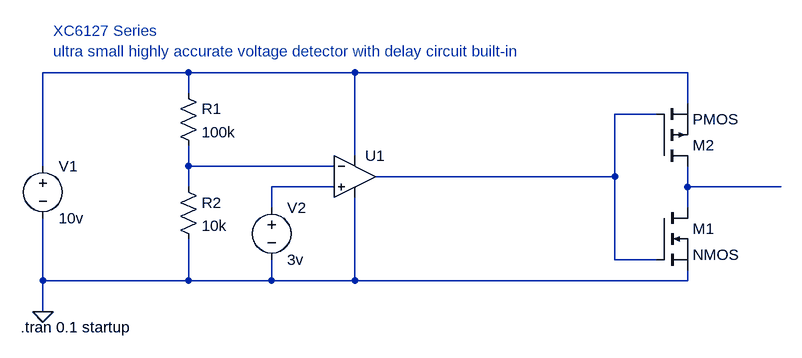
[diagram p0: schematic XC6127_voltage_detector_with_delay.asc]
XC6127_voltage_detector_with_delay.asc, the LTspice schematic file:
Version 4
SHEET 1 1204 680
WIRE 288 -16 64 -16
WIRE 544 -16 288 -16
WIRE 1056 -16 544 -16
WIRE 288 16 288 -16
WIRE 1056 32 1056 -16
WIRE 1008 48 944 48
WIRE 544 112 544 -16
WIRE 64 128 64 -16
WIRE 288 128 288 96
WIRE 512 128 288 128
WIRE 944 144 944 48
WIRE 944 144 576 144
WIRE 288 160 288 128
WIRE 512 160 416 160
WIRE 1056 160 1056 128
WIRE 1200 160 1056 160
WIRE 416 192 416 160
WIRE 1056 192 1056 160
WIRE 944 272 944 144
WIRE 1008 272 944 272
WIRE 64 304 64 208
WIRE 288 304 288 240
WIRE 288 304 64 304
WIRE 416 304 416 272
WIRE 416 304 288 304
WIRE 544 304 544 176
WIRE 544 304 416 304
WIRE 1056 304 1056 288
WIRE 1056 304 544 304
WIRE 64 352 64 304
FLAG 64 352 0
SYMBOL voltage 64 112 R0
WINDOW 123 0 0 Left 0
WINDOW 39 0 0 Left 0
SYMATTR InstName V1
SYMATTR Value 10v
SYMBOL res 272 0 R0
SYMATTR InstName R1
SYMATTR Value 100k
SYMBOL res 272 144 R0
SYMATTR InstName R2
SYMATTR Value 10k
SYMBOL voltage 416 176 R0
WINDOW 123 0 0 Left 0
WINDOW 39 0 0 Left 0
SYMATTR InstName V2
SYMATTR Value 3v
SYMBOL OpAmps\\UniversalOpamp2 544 144 R0
SYMATTR InstName U1
SYMBOL nmos 1008 192 R0
SYMATTR InstName M1
SYMBOL pmos 1008 128 M180
SYMATTR InstName M2
TEXT 30 376 Left 2 !.tran 0.1 startup
TEXT 80 -80 Left 2 ;XC6127 Series\nultra small highly accurate voltage detector with delay circuit built-in

The netlist it stands for:
* XC6127_voltage_detector_with_delay.asc
V1 N001 0 10v
R1 N001 N003 100k
R2 N003 0 10k
V2 N004 0 3v
XU1 N004 N003 N001 0 N002 level.2 Avol=1Meg GBW=10Meg Slew=10Meg ilimit=25m rail=0 Vos=0 phimargin=45 en=0 enk=0 in=0 ink=0 Rin=500Meg  ; pins IN+ IN- V+ V- OUT
M1 N005 N002 0 0 NMOS
M2 N005 N002 N001 N001 PMOS
.model NMOS NMOS
.model PMOS PMOS
.lib standard.mos
.tran 0.1 startup
* XC6127 Series
* ultra small highly accurate voltage detector with delay circuit built-in
.lib UniversalOpamps2.sub
.backanno
.end